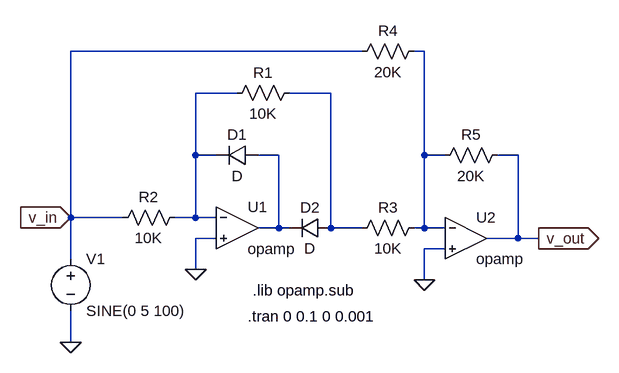
[diagram p0: schematic percision_full_wave_rectifier.asc]
percision_full_wave_rectifier.asc, the LTspice schematic file:
Version 4
SHEET 1 880 680
WIRE 320 -96 -128 -96
WIRE 416 -96 400 -96
WIRE 128 -32 64 -32
WIRE 272 -32 208 -32
WIRE 64 64 64 -32
WIRE 96 64 64 64
WIRE 192 64 160 64
WIRE 416 64 416 -96
WIRE 448 64 416 64
WIRE 560 64 528 64
WIRE -128 160 -128 -96
WIRE -48 160 -128 160
WIRE 64 160 64 64
WIRE 64 160 32 160
WIRE 96 160 64 160
WIRE 192 176 192 64
WIRE 192 176 160 176
WIRE 208 176 192 176
WIRE 272 176 272 -32
WIRE 320 176 272 176
WIRE 416 176 416 64
WIRE 416 176 400 176
WIRE 448 176 416 176
WIRE 96 192 64 192
WIRE 560 192 560 64
WIRE 560 192 512 192
WIRE 592 192 560 192
WIRE 448 208 416 208
WIRE -128 224 -128 160
WIRE 64 240 64 192
WIRE 416 256 416 208
WIRE -128 352 -128 304
FLAG 64 240 0
FLAG -128 352 0
FLAG -128 160 v_in
IOPIN -128 160 In
FLAG 416 256 0
FLAG 592 192 v_out
IOPIN 592 192 Out
SYMBOL OpAmps\\opamp 128 112 R0
SYMATTR InstName U1
SYMBOL diode 160 48 R90
WINDOW 0 0 32 VBottom 2
WINDOW 3 32 32 VTop 2
SYMATTR InstName D1
SYMBOL diode 272 160 R90
WINDOW 0 0 32 VBottom 2
WINDOW 3 32 32 VTop 2
SYMATTR InstName D2
SYMBOL res 224 -48 R90
WINDOW 0 0 56 VBottom 2
WINDOW 3 32 56 VTop 2
SYMATTR InstName R1
SYMATTR Value 10K
SYMATTR SpiceLine tol=1 pwr=0.1
SYMBOL res 48 144 R90
WINDOW 0 0 56 VBottom 2
WINDOW 3 32 56 VTop 2
SYMATTR InstName R2
SYMATTR Value 10K
SYMATTR SpiceLine tol=1 pwr=0.1
SYMBOL voltage -128 208 R0
WINDOW 123 0 0 Left 0
WINDOW 39 0 0 Left 0
SYMATTR InstName V1
SYMATTR Value SINE(0 5 100)
SYMBOL OpAmps\\opamp 480 128 R0
SYMATTR InstName U2
SYMBOL res 416 160 R90
WINDOW 0 0 56 VBottom 2
WINDOW 3 32 56 VTop 2
SYMATTR InstName R3
SYMATTR Value 10K
SYMATTR SpiceLine tol=1 pwr=0.1
SYMBOL res 416 -112 R90
WINDOW 0 0 56 VBottom 2
WINDOW 3 32 56 VTop 2
SYMATTR InstName R4
SYMATTR Value 20K
SYMATTR SpiceLine tol=1 pwr=0.1
SYMBOL res 544 48 R90
WINDOW 0 0 56 VBottom 2
WINDOW 3 32 56 VTop 2
SYMATTR InstName R5
SYMATTR Value 20K
SYMATTR SpiceLine tol=1 pwr=0.1
TEXT 144 312 Left 2 !.tran 0 0.1 0 0.001
TEXT 152 272 Left 2 !.lib opamp.sub

The netlist it stands for:
* percision_full_wave_rectifier.asc
XU1 N002 0 N004 opamp Aol=100K GBW=10Meg  ; pins invin noninvin out
D1 N004 N002 D
D2 N003 N004 D
R1 N003 N002 10K tol=1 pwr=0.1
R2 N002 v_in 10K tol=1 pwr=0.1
V1 v_in 0 SINE(0 5 100)
XU2 N001 0 v_out opamp Aol=100K GBW=10Meg  ; pins invin noninvin out
R3 N001 N003 10K tol=1 pwr=0.1
R4 N001 v_in 20K tol=1 pwr=0.1
R5 v_out N001 20K tol=1 pwr=0.1
.model D D
.lib standard.dio
.tran 0 0.1 0 0.001
.lib opamp.sub
.backanno
.end